# Altium schematic sheet 湿度和温度.SchDoc
size A4
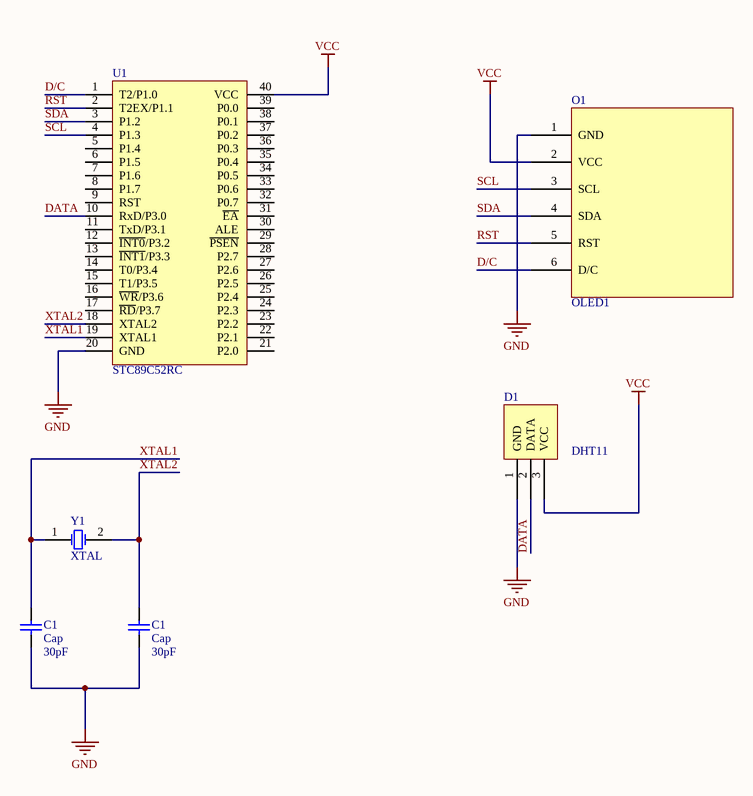
[diagram p0: 湿度和温度.SchDoc]

## Parts
(Parts that share a designator on the sheet are numbered #1, #2 ... from top to bottom, then left to right.)
C1#1  Cap  value 30pF  [RAD-0.3]
C1#2  Cap  value 30pF  [RAD-0.3]
D1  DHT11
O1  OLED1
U1  STC89C52RC  [DIP40-600]
Y1  XTAL  [R38]

## Nets
GND: C1#1.1 C1#2.1 D1.1(GND) O1.1(GND) U1.20(GND)
VCC: D1.3(VCC) O1.2(VCC) U1.40(VCC)
D/C: O1.6(D/C) U1.1(T2/P1.0)
DATA: D1.2(DATA) U1.10(RxD/P3.0)
RST: O1.5(RST) U1.2(T2EX/P1.1)
SCL: O1.3(SCL) U1.4(P1.3)
SDA: O1.4(SDA) U1.3(P1.2)
XTAL1: C1#1.2 U1.19(XTAL1) Y1.1(OSC1)
XTAL2: C1#2.2 U1.18(XTAL2) Y1.2(OSC2)

Not connected (* = marked no-connect by the designer): U1 5(P1.4) 6(P1.5) 7(P1.6) 8(P1.7) 9(RST) 11(TxD/P3.1) 12(~{INT0}/P3.2) 13(~{INT1}/P3.3) 14(T0/P3.4) 15(T1/P3.5) 16(~{WR}/P3.6) 17(~{RD}/P3.7) 21(P2.0) 22(P2.1) 23(P2.2) 24(P2.3) 25(P2.4) 26(P2.5) 27(P2.6) 28(P2.7) 29(~{PSEN}) 30(ALE) 31(~{EA}) 32(P0.7) 33(P0.6) 34(P0.5) 35(P0.4) 36(P0.3) 37(P0.2) 38(P0.1) 39(P0.0)

## Library data of the parts
C1#1 C1#2 = Cap: Capacitor; Published: 8-Jun-2000; LatestRevisionDate: 17-Jul-2002; LatestRevisionNote: Re-released for DXP Platform.; PackageReference: RAD-0.3; Publisher: Altium Limited; PackageDescription: Radial Cap, Thru-Hole; 2 Leads; 0.3 in Pin Spacing
D1 O1 = Component_1
U1 = STC89C52RC: STC单片机; 版权归属: 源创客; BOM名称: STC单片机; 学习资源: www.ooocke.com
Y1 = XTAL: Crystal Oscillator; Published: 8-Jun-2000; LatestRevisionDate: 17-Jul-2002; LatestRevisionNote: Re-released for DXP Platform.; PackageReference: R38; Publisher: Altium Limited; PackageDescription: Crystal, Thru-Hole; 2 Leads; Body 3.1 x 8.2 mm (Dia.xH)